# Altium schematic sheet Sensors.SchDoc: Sensors
size 431 x 279 mm; VersionControl_RevNumber: 1.0; VersionControl_ProjFolderRevNumber: 1.0.0; ApprovedBy: ESE; CheckedBy: Justin, Bhagath; Author: Justin, bhagath; CompanyName: ESE Dept; DrawnBy: Justin, Bhagath; Engineer: Justin, Bhagath; Organization: ORGANIZATION; Address1: Electrical Engineering; Address2: 200 S 33rd St; Address3: Philadelphia; Address4: Pa 19104; DocumentNumber: 6; Revision: -; SheetNumber: 6; SheetTotal: 7; Project: ProtoWatch; ENG_APP_DATE: 02/12/21; DSN_APP_DATE: 02/12/21; CHK_APP_DATE: 02/12/21
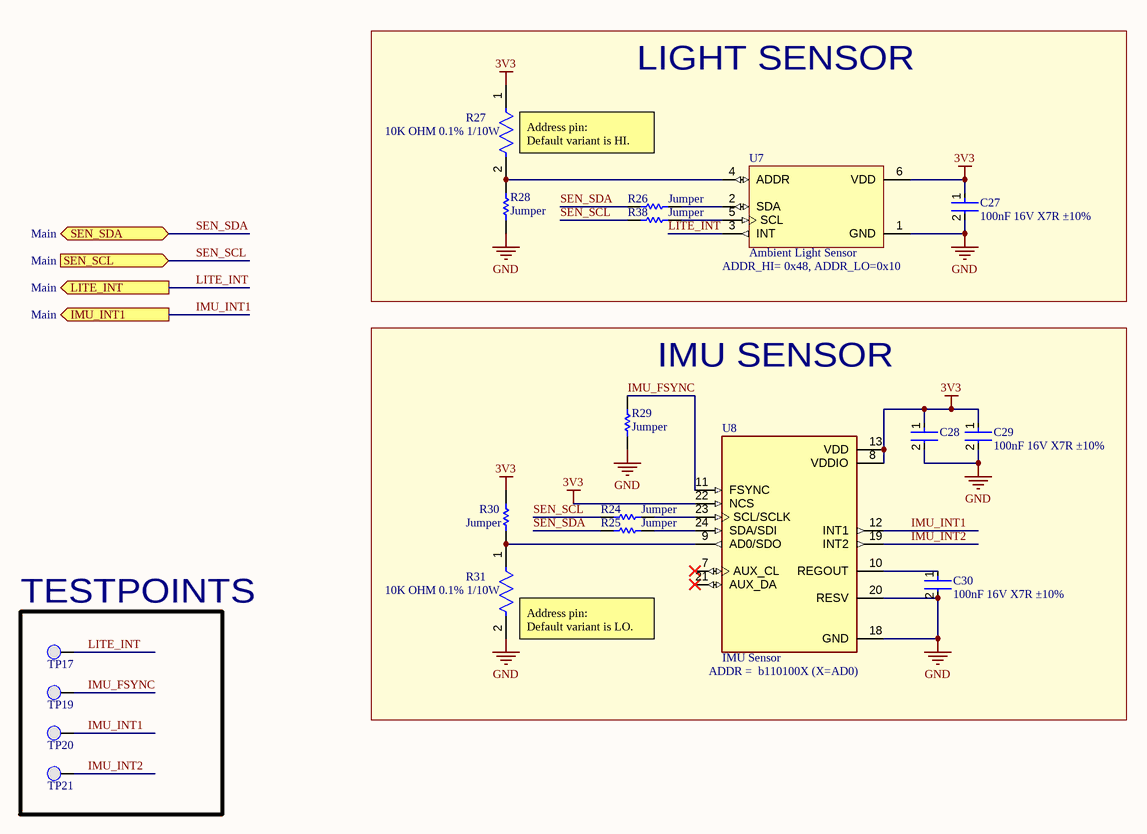
[diagram p0: Sensors.SchDoc]

## Parts
C27  100nF 16V X7R ±10%  [FP-CL10-IPC_A]
C28  100nF 16V X7R ±10%  [FP-CL10-IPC_A]  (value not drawn)
C29  100nF 16V X7R ±10%  [FP-CL10-IPC_A]
C30  100nF 16V X7R ±10%  [FP-CL10-IPC_A]
R24  Jumper  [RESC0603(1608)_N]
R25  Jumper  [RESC0603(1608)_N]
R26  Jumper  [RESC0603(1608)_N]
R27  10K OHM 0.1% 1/10W  [FP-RT0603-MFG]
R28  Jumper  [RESC0603(1608)_N]
R29  Jumper  [RESC0603(1608)_N]
R30  Jumper  [RESC0603(1608)_N]
R31  10K OHM 0.1% 1/10W  [FP-RT0603-MFG]
R38  Jumper  [RESC0603(1608)_N]
TP17  0.1" Pad  [PCBComponent]  (value not drawn)  (no BOM)
TP19  0.1" Pad  [PCBComponent]  (value not drawn)  (no BOM)
TP20  0.1" Pad  [PCBComponent]  (value not drawn)  (no BOM)
TP21  0.1" Pad  [PCBComponent]  (value not drawn)  (no BOM)
U7  Ambient Light Sensor  [VISHAY_VEML6030_2X2X0.87]
U8  IMU Sensor  [ICM-20649]

## Blocks framed on the sheet
LIGHT SENSOR: C27 R26-R28 R38 U7
IMU SENSOR: C28-C30 R24 R25 R29-R31 U8
TESTPOINTS: TP17 TP19-TP21

## Ports
IMU_INT1 (out, see Main), LITE_INT (out, see Main), SEN_SCL (in, see Main), SEN_SDA (bidir, see Main)

## Nets
3V3: C27.1 C28.1 C29.1 R27.1 R30.2 U7.6(VDD) U8.8(VDDIO) U8.13(VDD) U8.22(NCS)
GND: C27.2 C28.2 C29.2 C30.2 R28.1 R29.1 R31.2 U7.1(GND) U8.18(GND) U8.20(RESV)
IMU_FSYNC: R29.2 TP19.1(PAD) U8.11(FSYNC)
IMU_INT1: TP20.1(PAD) U8.12(INT1) ; port IMU_INT1
IMU_INT2: TP21.1(PAD) U8.19(INT2)
LITE_INT: TP17.1(PAD) U7.3(INT) ; port LITE_INT
SEN_SCL: R24.2 R38.2 ; port SEN_SCL
SEN_SDA: R25.2 R26.2 ; port SEN_SDA
NetC30_1: C30.1 U8.10(REGOUT)
NetR24_1: R24.1 U8.23(SCL/SCLK)
NetR25_1: R25.1 U8.24(SDA/SDI)
NetR26_1: R26.1 U7.2(SDA)
NetR27_2: R27.2 R28.2 U7.4(ADDR)
NetR30_1: R30.1 R31.1 U8.9(AD0/SDO)
NetR38_1: R38.1 U7.5(SCL)

Not connected (* = marked no-connect by the designer): U8 7(AUX_CL)* 21(AUX_DA)*

## Notes on the sheet
- (near R27) Address pin:
  Default variant is HI.
- (near U7) ADDR_HI= 0x48, ADDR_LO=0x10
- (near R31) Address pin:
  Default variant is LO.
- (near U8) ADDR =  b110100X (X=AD0)
- DWG. NO.
- REV.
- SHT.
- THIS DOCUMENT AND THE DATA DISCLOSED HEREIN OR HEREWITH IS THE PROPERTY OF ALTIUM LIMITED AND MAY BE FREELY DISTRIBUTED IN WHOLE. NO RIGHTS ARE RESERVED OR EXPRESS OR IMPLIED WARANTEE GIVEN.
- REVISION
- DESCRIPTION
- DATE
- APPROVED
- ENG:
- APPROVALS
- PROJECT
- DSN:
- CHK:
- REFERENCE DOCUMENTS
- PROJECT REVISION:
- TITLE
- DOCUMENT REVISION:
- DESIGN ITEM:
- BOM:
- FAB DWG:
- PCB DWG:
- ASSY DWG:
- SCALE:
- SIZE
- B
- CAGE CODE
- FILE NAME
- DWG NO.
- SHEET
- OF
- REV

## Library data of the parts
C27-C30 = CMP-13271-002478-1: Cap Ceramic 100nF 16V X7R ±10% Pad SMD 0603 +125°C T/R CL10B104KO8NNNL; Width: 0.031inch; Case/Package: 0603; Depth: 0.8mm; Packaging: Tape and Reel; Min Operating Temperature: -55°C; Thickness: 0.035inch; Voltage Rating: 16V; Radiation Hardening: No; Package Quantity: 15000; Voltage Rating (DC): 16V; Max Operating Temperature: 125°C; Voltage: 16V; Tolerance: 10%; Dielectric: X7R; Capacitance: 100nF; Lead Free: Lead Free; Height: 0.8mm; Mount: Surface Mount; Length: 1.6mm
R24-R26 R28-R30 R38 = CMP-1012-00001-1: Jumper 0603 (1608 Metric); Case-Metric: 1608; Value: 0.00 Ohm; Power: None; Case-EIA: 0603; Technology: SMT; Tolerance: None
R27 R31 = CMP-2000-04341-2: RES SMD 10K OHM 0.1% 1/10W 0603 RT0603BRB0710KL; Manufacturer: Yageo; Temperature Coefficient: 10 ppm/°C; Tolerance: 0.001; Value: 10KΩ; Power Rating: 0.1W; Voltage Rating: 75V; Lead Free: Yes; ComponentLink2URL: http://www.yageo.com/documents/recent/PYu-RT_1-to-0.01_RoHS_L_9.pdf; Temperature: -55°C to +155°C; Device Class L1: Passive Components; Device Class L3: Chip SMD Resistors; Footprint Url: http://www.yageo.com/exep/pages/download/literatures/PYu-R_Mount_10.pdf; Mouser Description: Thin Film Resistors - SMD 1/10W 10K ohm .1% 10ppm; Ipc Land Pattern Name: RESC16080X45; Device Class L2: Resistors; Manufacturer Part Number: RT0603BRB0710KL; Series: RT; Composition: Thin Film; Temperature Range High: +155°C; RoHS: TRUE; Temperature Range Low: -55°C; Package: RT0603; Octopart: https://octopart.com/rt0603brb0710kl-yageo-22252377; Automotive: No; Height: 0.55mm; Digikey Description: RES SMD 10K OHM 0.1% 1/10W 0603; Category: Res; ComponentLink2Description: Datasheet; Resistance: 10KΩ
TP17 TP19-TP21 = 0.1" Pad-A.4
U7 = VEML6030: Optical Sensor Ambient 550nm IÂ²C 6-SMD, No Lead; MF: Vishay; Value: *; Price: None; Package: SMD-6 Vishay; SnapEDA_Link: https://www.snapeda.com/parts/VEML6030/Vishay%20Semiconductor%20Opto%20Division/view-part/493148/?ref=snap; Availability: Unavailable; MP: VEML6030; Manufacturer Part Number 1: VEML6030
U8 = ICM-20649: Accelerometer, Gyroscope, Temperature, 6 Axis Sensor IÂ²C, SPI Output; MF: TDK InvenSense; Package: QFN-24 InvenSense; Price: None; Availability: Unavailable; MP: ICM-20649; SnapEDA_Link: https://www.snapeda.com/parts/ICM-20649/TDK%20InvenSense/view-part/557276/?ref=snap; Value: *; Manufacturer Part Number 1: ICM-20649